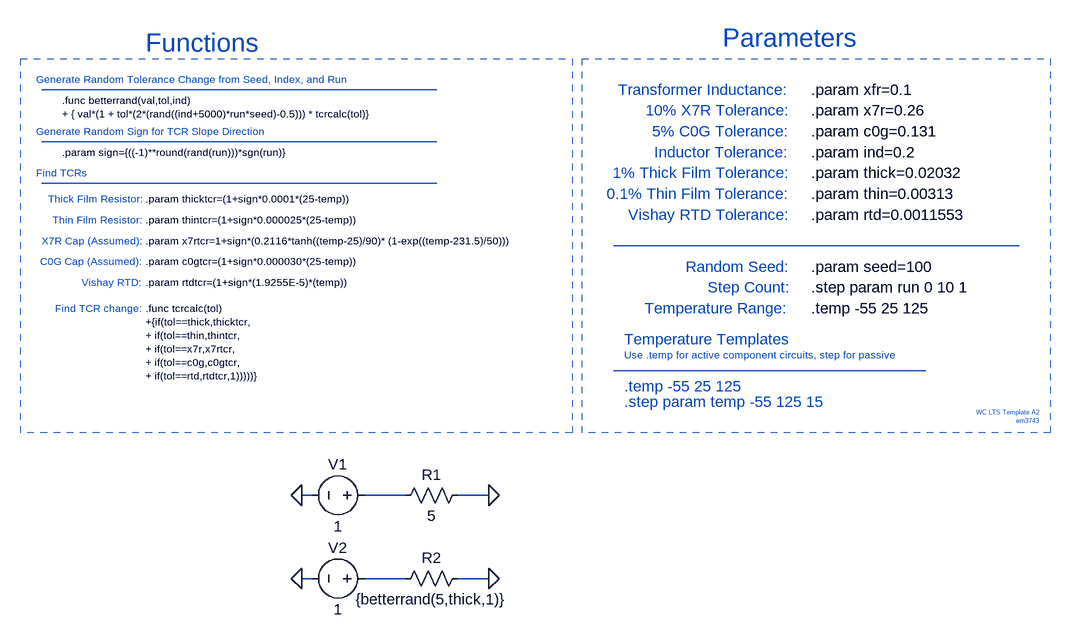
[diagram p0: schematic Draft1.asc]
Draft1.asc, the LTspice schematic file:
Version 4
SHEET 1 1044 1088
WIRE -96 896 -112 896
WIRE 48 896 -16 896
WIRE 176 896 128 896
WIRE -96 1024 -112 1024
WIRE 48 1024 -16 1024
WIRE 176 1024 128 1024
FLAG -112 896 0
FLAG 176 896 0
FLAG -112 1024 0
FLAG 176 1024 0
SYMBOL voltage 0 896 R90
WINDOW 0 -32 56 VBottom 2
WINDOW 3 32 56 VTop 2
WINDOW 123 0 0 Left 0
WINDOW 39 0 0 Left 0
SYMATTR InstName V1
SYMATTR Value 1
SYMBOL res 144 880 R90
WINDOW 0 0 56 VBottom 2
WINDOW 3 32 56 VTop 2
SYMATTR InstName R1
SYMATTR Value 5
SYMBOL voltage 0 1024 R90
WINDOW 0 -32 56 VBottom 2
WINDOW 3 32 56 VTop 2
WINDOW 123 0 0 Left 0
WINDOW 39 0 0 Left 0
SYMATTR InstName V2
SYMATTR Value 1
SYMBOL res 144 1008 R90
WINDOW 0 0 56 VBottom 2
WINDOW 3 32 56 VTop 2
SYMATTR InstName R2
SYMATTR Value {betterrand(5,thick,1)}
TEXT 672 304 Left 2 !.param x7r=0.26
TEXT 672 400 Left 2 !.param thick=0.02032
TEXT 672 432 Left 2 !.param thin=0.00313
TEXT -480 288 Left 1 !.func betterrand(val,tol,ind)\n+ { val*(1 + tol*(2*(rand((ind+5000)*run*seed)-0.5))) * tcrcalc(tol)}
TEXT 672 272 Left 2 !.param xfr=0.1
TEXT 672 368 Left 2 !.param ind=0.2
TEXT -352 608 Left 1 !.func tcrcalc(tol)\n+{if(tol==thick,thicktcr, \n+ if(tol==thin,thintcr,\n+ if(tol==x7r,x7rtcr,\n+ if(tol==c0g,c0gtcr,\n+ if(tol==rtd,rtdtcr,1)))))}
TEXT -352 440 Left 1 !.param thicktcr=(1+sign*0.0001*(25-temp))
TEXT -352 472 Left 1 !.param thintcr=(1+sign*0.000025*(25-temp))
TEXT -480 368 Left 1 !.param sign={((-1)**round(rand(run)))*sgn(run)}
TEXT 672 576 Left 2 !.step param run 0 10 1
TEXT 672 608 Left 2 !.temp -55 25 125
TEXT 384 680 Left 1 ;Use .temp for active component circuits, step for passive
TEXT -352 504 Left 1 !.param x7rtcr=1+sign*(0.2116*tanh((temp-25)/90)* (1-exp((temp-231.5)/50)))
TEXT -360 440 Right 1 ;Thick Film Resistor:
TEXT -360 472 Right 1 ;Thin Film Resistor:
TEXT -360 504 Right 1 ;X7R Cap (Assumed):
TEXT 640 272 Right 2 ;Transformer Inductance:
TEXT 640 304 Right 2 ;10% X7R Tolerance:
TEXT 640 368 Right 2 ;Inductor Tolerance:
TEXT 640 400 Right 2 ;1% Thick Film Tolerance:
TEXT 640 432 Right 2 ;0.1% Thin Film Tolerance:
TEXT 672 544 Left 2 !.param seed=100
TEXT -360 608 Right 1 ;Find TCR change:
TEXT -520 256 Left 1 ;Generate Random Tolerance Change from Seed, Index, and Run
TEXT 640 544 Right 2 ;Random Seed:
TEXT 384 656 Left 2 ;Temperature Templates
TEXT 384 728 Left 2 ;.temp -55 25 125
TEXT 384 752 Left 2 ;.step param temp -55 125 15
TEXT -520 336 Left 1 ;Generate Random Sign for TCR Slope Direction
TEXT 640 608 Right 2 ;Temperature Range:
TEXT 640 576 Right 2 ;Step Count:
TEXT -520 400 Left 1 ;Find TCRs
TEXT 536 192 Left 4 ;Parameters
TEXT -352 200 Left 4 ;Functions
TEXT -352 536 Left 1 !.param c0gtcr=(1+sign*0.000030*(25-temp))
TEXT -360 536 Right 1 ;C0G Cap (Assumed):
TEXT 672 336 Left 2 !.param c0g=0.131
TEXT 640 336 Right 2 ;5% C0G Tolerance:
TEXT -360 568 Right 1 ;Vishay RTD:
TEXT 672 464 Left 2 !.param rtd=0.0011553
TEXT 640 464 Right 2 ;Vishay RTD Tolerance:
TEXT -352 568 Left 1 !.param rtdtcr=(1+sign*(1.9255E-5)*(temp))
TEXT 1024 768 Right 0 ;WC LTS Template A2\nem3743
LINE Normal 992 512 368 512
LINE Normal 848 704 368 704
LINE Normal 96 272 -512 272
LINE Normal 96 352 -512 352
LINE Normal 96 416 -512 416
RECTANGLE Normal 304 800 -544 224 2
RECTANGLE Normal 1040 800 320 224 2

The netlist it stands for:
* Draft1.asc
V1 N001 0 1
R1 0 N001 5
V2 N002 0 1
R2 0 N002 {betterrand(5,thick,1)}
.param x7r=0.26
.param thick=0.02032
.param thin=0.00313
.func betterrand(val,tol,ind)
+ { val*(1 + tol*(2*(rand((ind+5000)*run*seed)-0.5))) * tcrcalc(tol)}
.param xfr=0.1
.param ind=0.2
.func tcrcalc(tol)
+{if(tol==thick,thicktcr,
+ if(tol==thin,thintcr,
+ if(tol==x7r,x7rtcr,
+ if(tol==c0g,c0gtcr,
+ if(tol==rtd,rtdtcr,1)))))}
.param thicktcr=(1+sign*0.0001*(25-temp))
.param thintcr=(1+sign*0.000025*(25-temp))
.param sign={((-1)**round(rand(run)))*sgn(run)}
.step param run 0 10 1
.temp -55 25 125
* Use .temp for active component circuits, step for passive
.param x7rtcr=1+sign*(0.2116*tanh((temp-25)/90)* (1-exp((temp-231.5)/50)))
* Thick Film Resistor:
* Thin Film Resistor:
* X7R Cap (Assumed):
* Transformer Inductance:
* 10% X7R Tolerance:
* Inductor Tolerance:
* 1% Thick Film Tolerance:
* 0.1% Thin Film Tolerance:
.param seed=100
* Find TCR change:
* Generate Random Tolerance Change from Seed, Index, and Run
* Random Seed:
* Temperature Templates
* .temp -55 25 125
* .step param temp -55 125 15
* Generate Random Sign for TCR Slope Direction
* Temperature Range:
* Step Count:
* Find TCRs
* Parameters
* Functions
.param c0gtcr=(1+sign*0.000030*(25-temp))
* C0G Cap (Assumed):
.param c0g=0.131
* 5% C0G Tolerance:
* Vishay RTD:
.param rtd=0.0011553
* Vishay RTD Tolerance:
.param rtdtcr=(1+sign*(1.9255E-5)*(temp))
* WC LTS Template A2
* em3743
.backanno
.end